# Altium schematic sheet Connector.SchDoc
size A4; SheetNumber: 6; SheetTotal: 6; ProjectTitle: PD_SMARTKEY_EMN-EVAN_V2
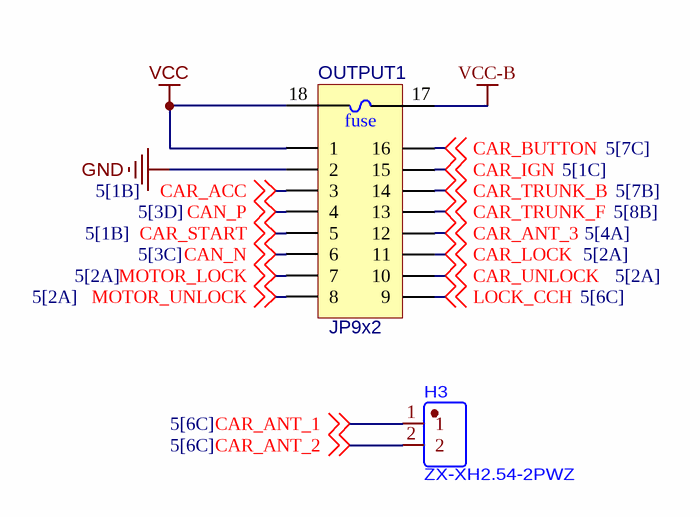
[diagram p0: Connector.SchDoc]

## Parts
H3  ZX-XH2.54-2PWZ  [ZX-XH2.54-2PWZ]
OUTPUT1  JP9x2  [9x2_JP200]

## Nets
GND: OUTPUT1.2
VCC: OUTPUT1.1 OUTPUT1.18
VCC-B: OUTPUT1.17
CAN_N: OUTPUT1.6 ; off-sheet CAN_N
CAN_P: OUTPUT1.4 ; off-sheet CAN_P
CAR_ACC: OUTPUT1.3 ; off-sheet CAR_ACC
CAR_ANT_1: H3.1 ; off-sheet CAR_ANT_1
CAR_ANT_2: H3.2 ; off-sheet CAR_ANT_2
CAR_ANT_3: OUTPUT1.12 ; off-sheet CAR_ANT_3
CAR_BUTTON: OUTPUT1.16 ; off-sheet CAR_BUTTON
CAR_IGN: OUTPUT1.15 ; off-sheet CAR_IGN
CAR_LOCK: OUTPUT1.11 ; off-sheet CAR_LOCK
CAR_START: OUTPUT1.5 ; off-sheet CAR_START
CAR_TRUNK_B: OUTPUT1.14 ; off-sheet CAR_TRUNK_B
CAR_TRUNK_F: OUTPUT1.13 ; off-sheet CAR_TRUNK_F
CAR_UNLOCK: OUTPUT1.10 ; off-sheet CAR_UNLOCK
LOCK_CCH: OUTPUT1.9 ; off-sheet LOCK_CCH
MOTOR_LOCK: OUTPUT1.7 ; off-sheet MOTOR_LOCK
MOTOR_UNLOCK: OUTPUT1.8 ; off-sheet MOTOR_UNLOCK

## Notes on the sheet
- Author:
- Title:
- Size:
- A4
- Project:
- Approved:
- Revision:
- Modified Date:
- CONFIDENTIAL
- Date:
- SW Version:
- (in symbol JP9x2_1) fuse

## Library data of the parts
H3 = ZX-XH2.54-2PWZ: CONN HEADER TH R/A 2POS 2.5mm; Manufacturer: Megastar; MPN: ZX-XH2.54-2PWZ; LCSC Part #: C7429641; Packaging: Through Hole,Right Angle,P=2.5mm; Link: https://www.lcsc.com/product-detail/C7429641.html?utm_source=chatgpt.com
OUTPUT1 = JP9x2_1: WR-PHD 2.54 mm Dual Socket Header; Manufacturer: W¨¹rth Elektronik eiSos GmbH; partNo: 61301821821; ComponentLink1 Description: Manufacturer; ComponentLink2 Description: Datasheet; NoPins: 18; Created Date: 29 March 2013; ComponentLink1URL: http://www.we-online.com; ComponentLink2URL: http://katalog.we-online.de/em/datasheet/6130xx21821.pdf; Created by: Karrer Zheng